# Altium project TSE_sensor_commutation_board.PrjPcb
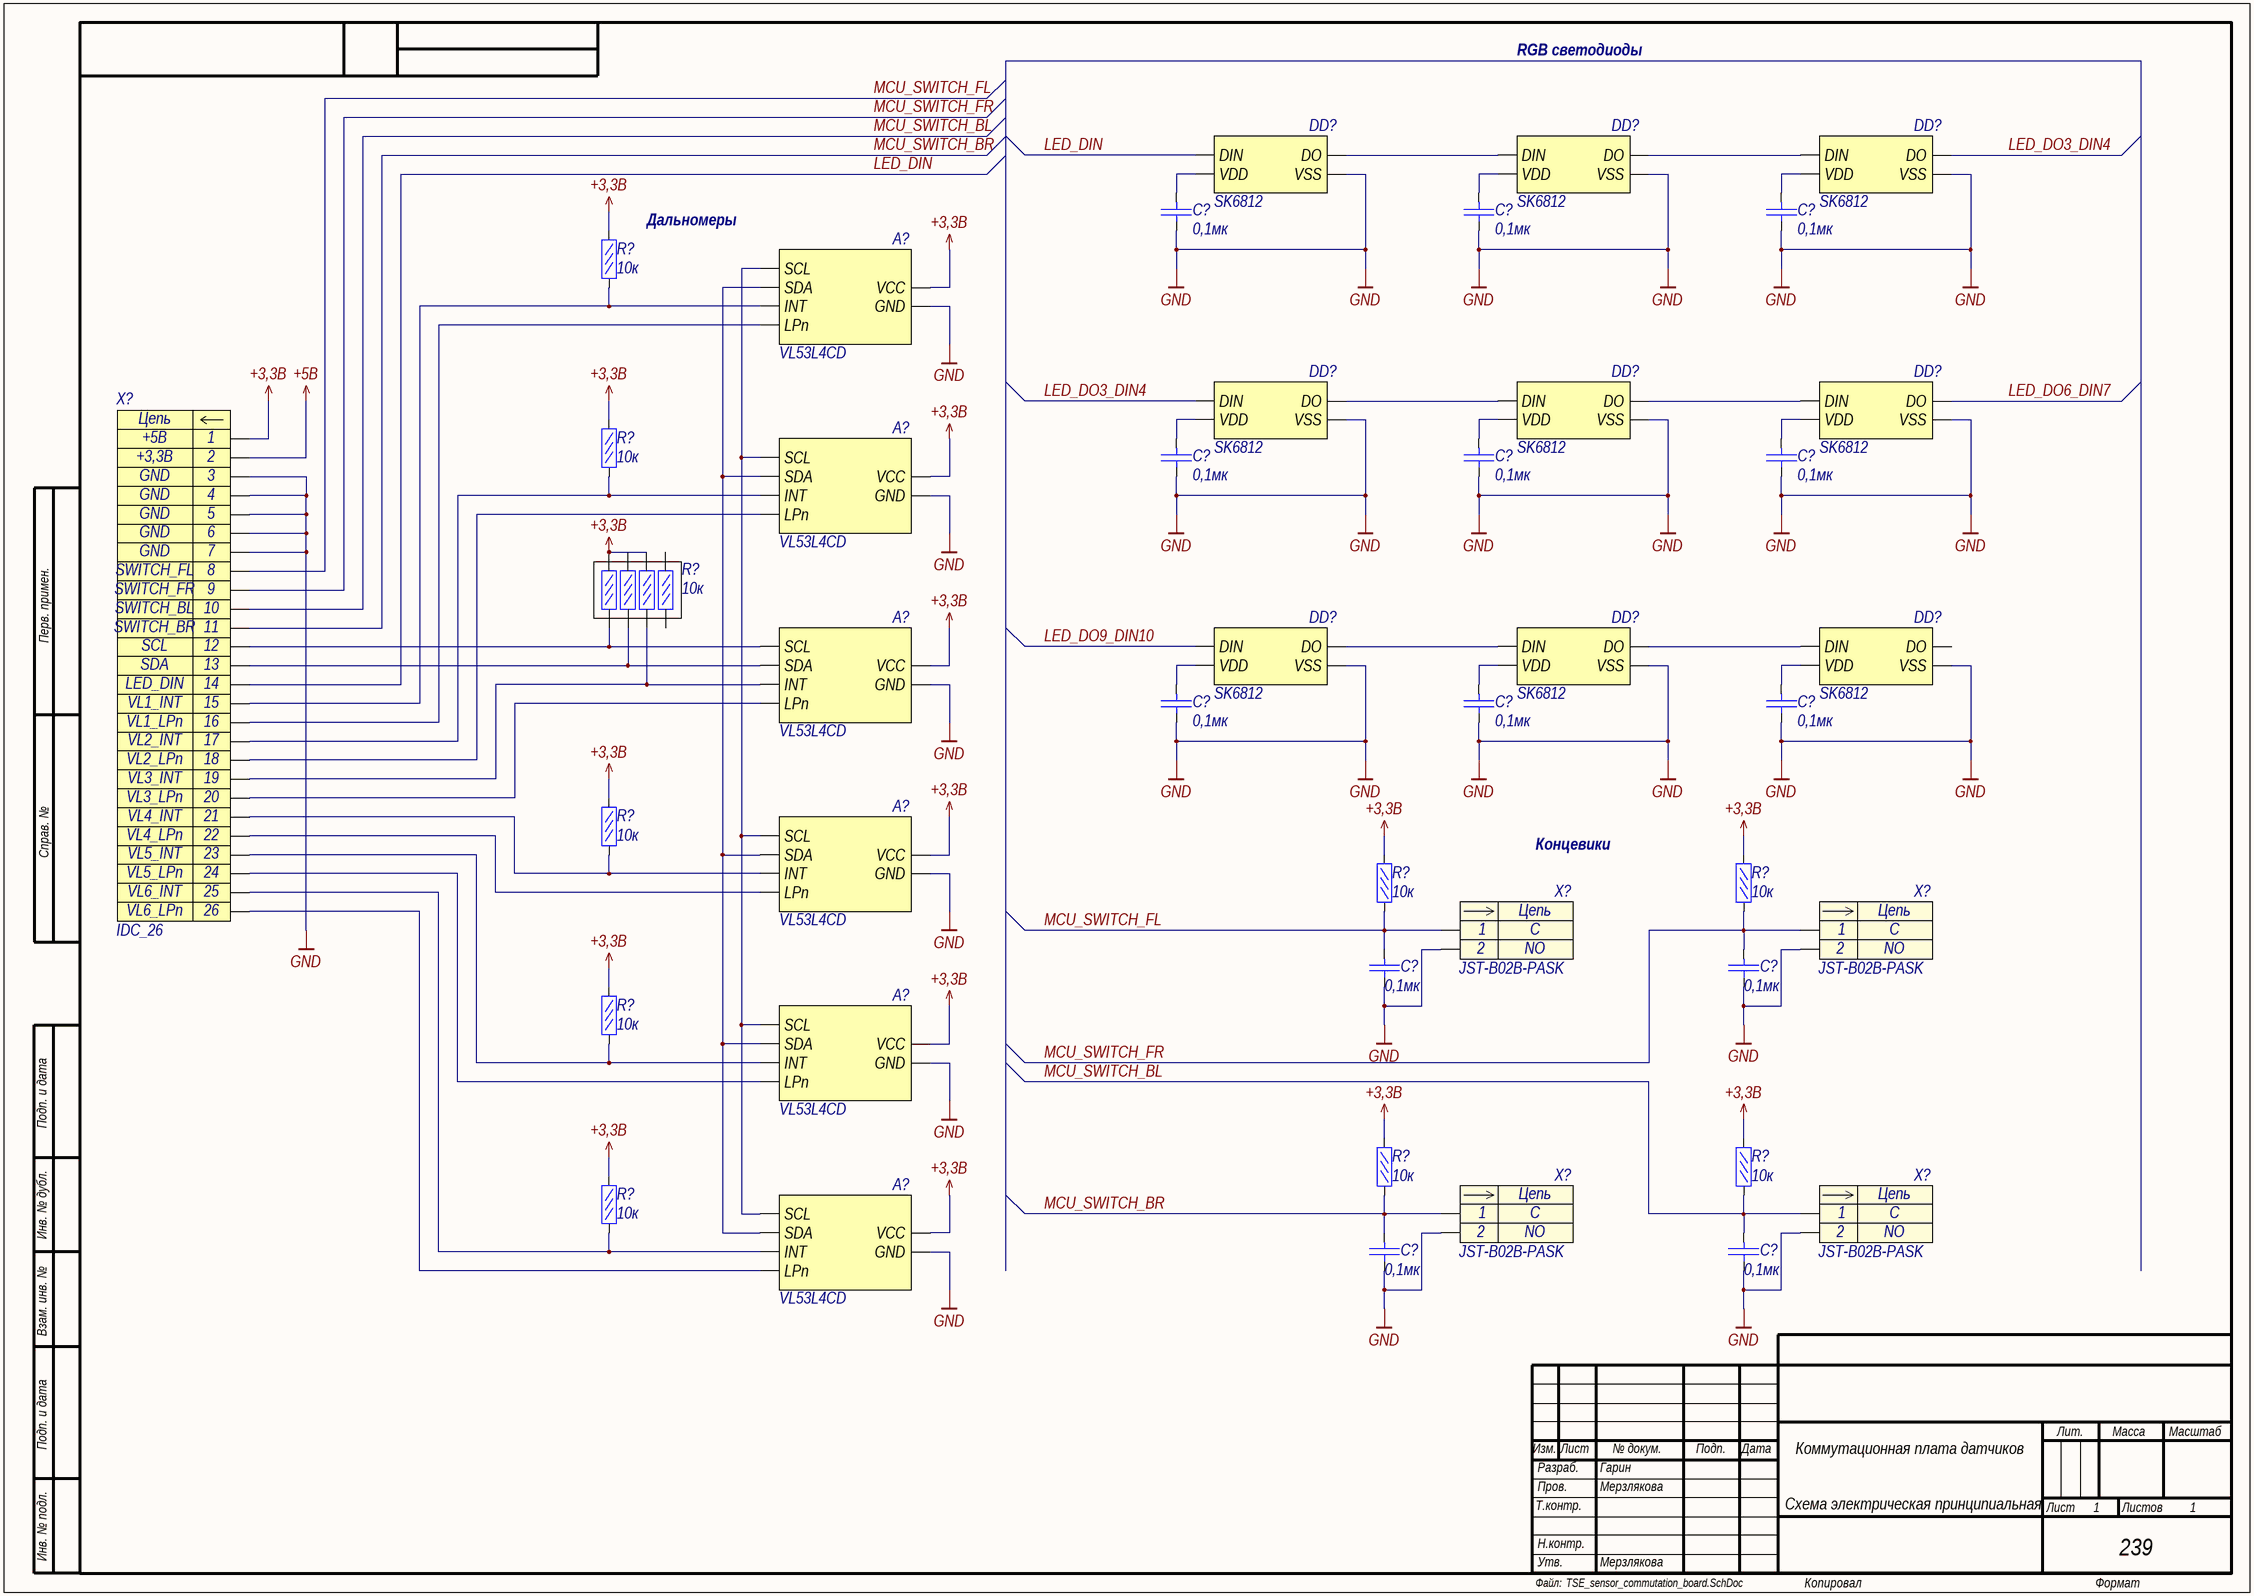
[diagram p0: TSE_sensor_commutation_board.SchDoc]
reviewer: Мерзлякова; document_type: Схема электрическая принципиальная; document_code: Э3; device_title: Коммутационная плата датчиков; developer: Гарин; company: 239; approver: Мерзлякова
1 sheet, 43 parts. Net scope: global (net labels, ports and power ports of the same name join across sheets).

## Sheet TSE_sensor_commutation_board.SchDoc
size 594 x 420 mm; SheetNumber: 1; SheetTotal: 1

### Parts
(Parts that share a designator on the sheet are numbered #1, #2 ... from top to bottom, then left to right.)
A?#1  VL53L4CD
A?#2  VL53L4CD
A?#3  VL53L4CD
A?#4  VL53L4CD
A?#5  VL53L4CD
A?#6  VL53L4CD
C?#1  0,1мк  [C0603]
C?#2  0,1мк  [C0603]
C?#3  0,1мк  [C0603]
C?#4  0,1мк  [C0603]
C?#5  0,1мк  [C0603]
C?#6  0,1мк  [C0603]
C?#7  0,1мк  [C0603]
C?#8  0,1мк  [C0603]
C?#9  0,1мк  [C0603]
C?#10  0,1мк  [C0603]
C?#11  0,1мк  [C0603]
C?#12  0,1мк  [C0603]
C?#13  0,1мк  [C0603]
DD?#1  SK6812
DD?#2  SK6812
DD?#3  SK6812
DD?#4  SK6812
DD?#5  SK6812
DD?#6  SK6812
DD?#7  SK6812
DD?#8  SK6812
DD?#9  SK6812
R?#1  10к  [R0603]
R?#2  10к  [R0603]
R?#3  10к
R?#4  10к  [R0603]
R?#5  10к  [R0603]
R?#6  10к  [R0603]
R?#7  10к  [R0603]
R?#8  10к  [R0603]
R?#9  10к  [R0603]
R?#10  10к  [R0603]
X?#1  IDC_26  [IDC1.27_26]
X?#2  JST-B02B-PASK
X?#3  JST-B02B-PASK
X?#4  JST-B02B-PASK
X?#5  JST-B02B-PASK

### Nets
+3,3В: A?#1.1(VCC) A?#2.1(VCC) A?#3.1(VCC) A?#4.1(VCC) A?#5.1(VCC) A?#6.1(VCC) R?#1.2 R?#2.2 R?#3.2 R?#3.4 R?#3.6 R?#4.2 R?#5.2 R?#6.2 R?#7.2 R?#8.2 R?#9.2 R?#10.2 X?#1.1
+5В: X?#1.2
GND: A?#1.2(GND) A?#2.2(GND) A?#3.2(GND) A?#4.2(GND) A?#5.2(GND) A?#6.2(GND) C?#1.1 C?#2.1 C?#3.1 C?#4.1 C?#5.1 C?#6.1 C?#7.1 C?#8.1 C?#9.1 C?#10.1 C?#11.1 C?#12.1 C?#13.1 DD?#1.4(VSS) DD?#2.4(VSS) DD?#3.4(VSS) DD?#4.4(VSS) DD?#5.4(VSS) DD?#6.4(VSS) DD?#7.4(VSS) DD?#8.4(VSS) DD?#9.4(VSS) X?#1.3 X?#1.4 X?#1.5 X?#1.6 X?#1.7 X?#2.2 X?#3.2 X?#4.2 X?#5.2
LED_DIN: DD?#1.3(DIN) X?#1.14
LED_DO3_DIN4: DD?#3.2(DO) DD?#4.3(DIN)
LED_DO6_DIN7: DD?#6.2(DO)
LED_DO9_DIN10: DD?#7.3(DIN)
MCU_SWITCH_BL: C?#13.2 R?#9.1 X?#1.10 X?#5.1
MCU_SWITCH_BR: C?#12.2 R?#8.1 X?#1.11 X?#4.1
MCU_SWITCH_FL: C?#10.2 R?#5.1 X?#1.8 X?#2.1
MCU_SWITCH_FR: C?#11.2 R?#6.1 X?#1.9 X?#3.1
NetA?#1_3: A?#1.3(SCL) A?#2.3(SCL) A?#4.3(SCL) A?#5.3(SCL) A?#6.3(SCL)
NetA?#1_4: A?#1.4(SDA) A?#2.4(SDA) A?#4.4(SDA) A?#5.4(SDA) A?#6.4(SDA)
NetA?#1_5: A?#1.5(INT) R?#1.1 X?#1.15
NetA?#1_6: A?#1.6(LPn) X?#1.16
NetA?#2_5: A?#2.5(INT) R?#2.1 X?#1.17
NetA?#2_6: A?#2.6(LPn) X?#1.18
NetA?#3_3: A?#3.3(SCL) R?#3.1 X?#1.12
NetA?#3_4: A?#3.4(SDA) R?#3.3 X?#1.13
NetA?#3_5: A?#3.5(INT) R?#3.5 X?#1.19
NetA?#3_6: A?#3.6(LPn) X?#1.20
NetA?#4_5: A?#4.5(INT) R?#4.1 X?#1.21
NetA?#4_6: A?#4.6(LPn) X?#1.22
NetA?#5_5: A?#5.5(INT) R?#7.1 X?#1.23
NetA?#5_6: A?#5.6(LPn) X?#1.24
NetA?#6_5: A?#6.5(INT) R?#10.1 X?#1.25
NetA?#6_6: A?#6.6(LPn) X?#1.26
NetC?#1_2: C?#1.2 DD?#1.1(VDD)
NetC?#2_2: C?#2.2 DD?#2.1(VDD)
NetC?#3_2: C?#3.2 DD?#3.1(VDD)
NetC?#4_2: C?#4.2 DD?#4.1(VDD)
NetC?#5_2: C?#5.2 DD?#5.1(VDD)
NetC?#6_2: C?#6.2 DD?#6.1(VDD)
NetC?#7_2: C?#7.2 DD?#7.1(VDD)
NetC?#8_2: C?#8.2 DD?#8.1(VDD)
NetC?#9_2: C?#9.2 DD?#9.1(VDD)
NetDD?#1_2: DD?#1.2(DO) DD?#2.3(DIN)
NetDD?#2_2: DD?#2.2(DO) DD?#3.3(DIN)
NetDD?#4_2: DD?#4.2(DO) DD?#5.3(DIN)
NetDD?#5_2: DD?#5.2(DO) DD?#6.3(DIN)
NetDD?#7_2: DD?#7.2(DO) DD?#8.3(DIN)
NetDD?#8_2: DD?#8.2(DO) DD?#9.3(DIN)

Not connected (* = marked no-connect by the designer): DD?#9 2(DO); R?#3 7 8

### Notes on the sheet
- RGB светодиоды
- Дальномеры
- Концевики
- Перв. примен.
- Справ. №
- Подп. и дата
- Инв. № дубл.
- Взам. инв. №
- Изм.
- Лист
- № докум.
- Подп.
- Дата
- Лит.
- Масса
- Масштаб
- Т.контр.
- Пров.
- Разраб.
- Листов
- Инв. № подл.
- Н.контр.
- Файл:
- Утв.
- Копировал
- Формат
- (in symbol IDC_26) Цепь
- (in symbol JST-B02B-PASK) Цепь

### Library data of the parts
A?#1-A?#6 = VL53L4CD: Лазерный дальномер; Наименование: VL53L4CD
C?#1-C?#13 = CC0603JPX7R9BB104: Конденсатор кер. 0,1мкФ 50В; Manufacturer: Yageo; TKE: X7R; Name: CC0603JPX7R9BB104; Value: 0,1мк
DD?#1-DD?#9 = SK6812: RGB-светодиод с боковым свечнием; Наименование: SK6812
R?#1 R?#2 R?#4-R?#10 = RC0603FR-0710KL: Резистор 10кОм 0,063Вт 1%; Manufacturer: YAGEO; Name: RC0603FR-0710KL; Tolerance: 1%; Value: 10к
R?#3 = RA-4_0.063W: Резисторная сборка 0,063Вт; ClassName: *; Номинал: 10к
X?#1 = IDC_26: Разъем - 26 конт. прямая вилка на плату; Contact_1: +5В; Contact_2: +3,3В; Contact_3: GND; Contact_8: SWITCH_FL; Contact_9: SWITCH_FR; Contact_10: SWITCH_BL; Contact_11: SWITCH_BR; Contact_12: SCL; Contact_13: SDA; Contact_14: LED_DIN; Contact_15: VL1_INT; Contact_16: VL1_LPn; Contact_17: VL2_INT; Contact_18: VL2_LPn; Contact_19: VL3_INT; Contact_20: VL3_LPn; Contact_21: VL4_INT; Contact_22: VL4_LPn; Contact_23: VL5_INT; Contact_24: VL5_LPn; Contact_25: VL6_INT; Contact_26: VL6_LPn; Наименование: IDC_26; Contact_4: GND; Contact_5: GND; Contact_6: GND; Contact_7: GND
X?#2-X?#5 = JST-B02B-PASK: Разъем - 2 конт. прямая вилка на плату, шаг 2,00 мм; Contact_1: C; Contact_2: NO; Наименование: JST-B02B-PASK